# Altium schematic sheet PWM.SchDoc
size A4
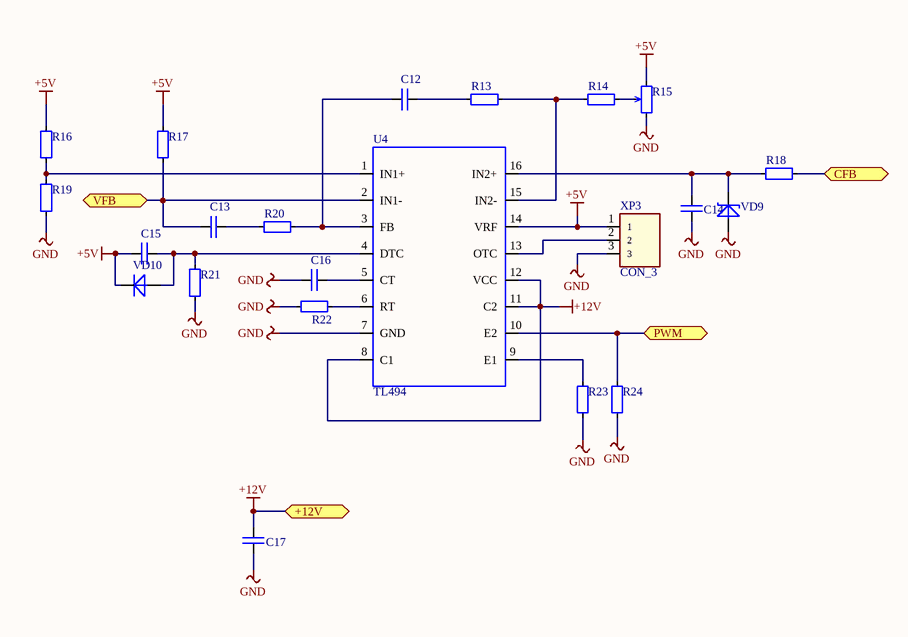
[diagram p0: PWM.SchDoc]

## Parts
C12  (no value)  [SMD_0805]
C13  (no value)  [SMD_0805]
C14  (no value)  [SMD_0805]
C15  (no value)  [SMD_1206]
C16  (no value)  [SMD_0805]
C17  (no value)  [SMD_0805]
R13  (no value)  [SMD_0805]
R14  (no value)  [SMD_0805]
R15  (no value)  [HEAD-1/3/2.54]
R16  (no value)  [SMD_0805]
R17  (no value)  [SMD_0805]
R18  (no value)  [SMD_0805]
R19  (no value)  [SMD_0805]
R20  (no value)  [SMD_0805]
R21  (no value)  [SMD_0805]
R22  (no value)  [SMD_0805]
R23  (no value)  [SMD_0805]
R24  (no value)  [SMD_0805]
U4  TL494  [SOIC-16]
VD9  (no value)  [SOD-123]
VD10  (no value)  [DIO-MELF_SOD-80]
XP3  CON_3  [HEAD-1/3/2.54]

## Ports
+12V, CFB, PWM, VFB

## Nets
+5V: C15.2 R15.2 R16.2 R17.2 U4.14(VRF) VD10.1(C) XP3.1
+12V: C17.1 U4.8(C1) U4.11(C2) U4.12(VCC) ; port +12V
GND: C14.1 C16.2 C17.2 R15.1 R19.1 R21.2 R22.2 R23.2 R24.2 U4.7(GND) VD9.2(A) XP3.3
CFB: R18.2 ; port CFB
PWM: R24.1 U4.10(E2) ; port PWM
VFB: C13.2 R17.1 U4.2(IN1-) ; port VFB
NetC12_1: C12.1 R13.2
NetC12_2: C12.2 R20.1 U4.3(FB)
NetC13_1: C13.1 R20.2
NetC14_2: C14.2 R18.1 U4.16(IN2+) VD9.1(C)
NetC15_1: C15.1 R21.1 U4.4(DTC) VD10.2(A)
NetC16_1: C16.1 U4.5(CT)
NetR13_1: R13.1 R14.2 U4.15(IN2-)
NetR14_1: R14.1 R15.3
NetR16_1: R16.1 R19.2 U4.1(IN1+)
NetR22_1: R22.1 U4.6(RT)
NetR23_1: R23.1 U4.9(E1)
NetU4_13: U4.13(OTC) XP3.2

## Library data of the parts
C12-C17 = C_NONE_POLAR: None polar capacitor
R13 R14 R16-R24 = RES: Resistor
R15 = RES_ADJ: Agjustable resistor
U4 = TL494: PWM controller
VD9 = ZENER: Zener diode
VD10 = DIODE: Case: *